# EAGLE schematic AUX power board (V4.0) (EAGLE 7.5.0)
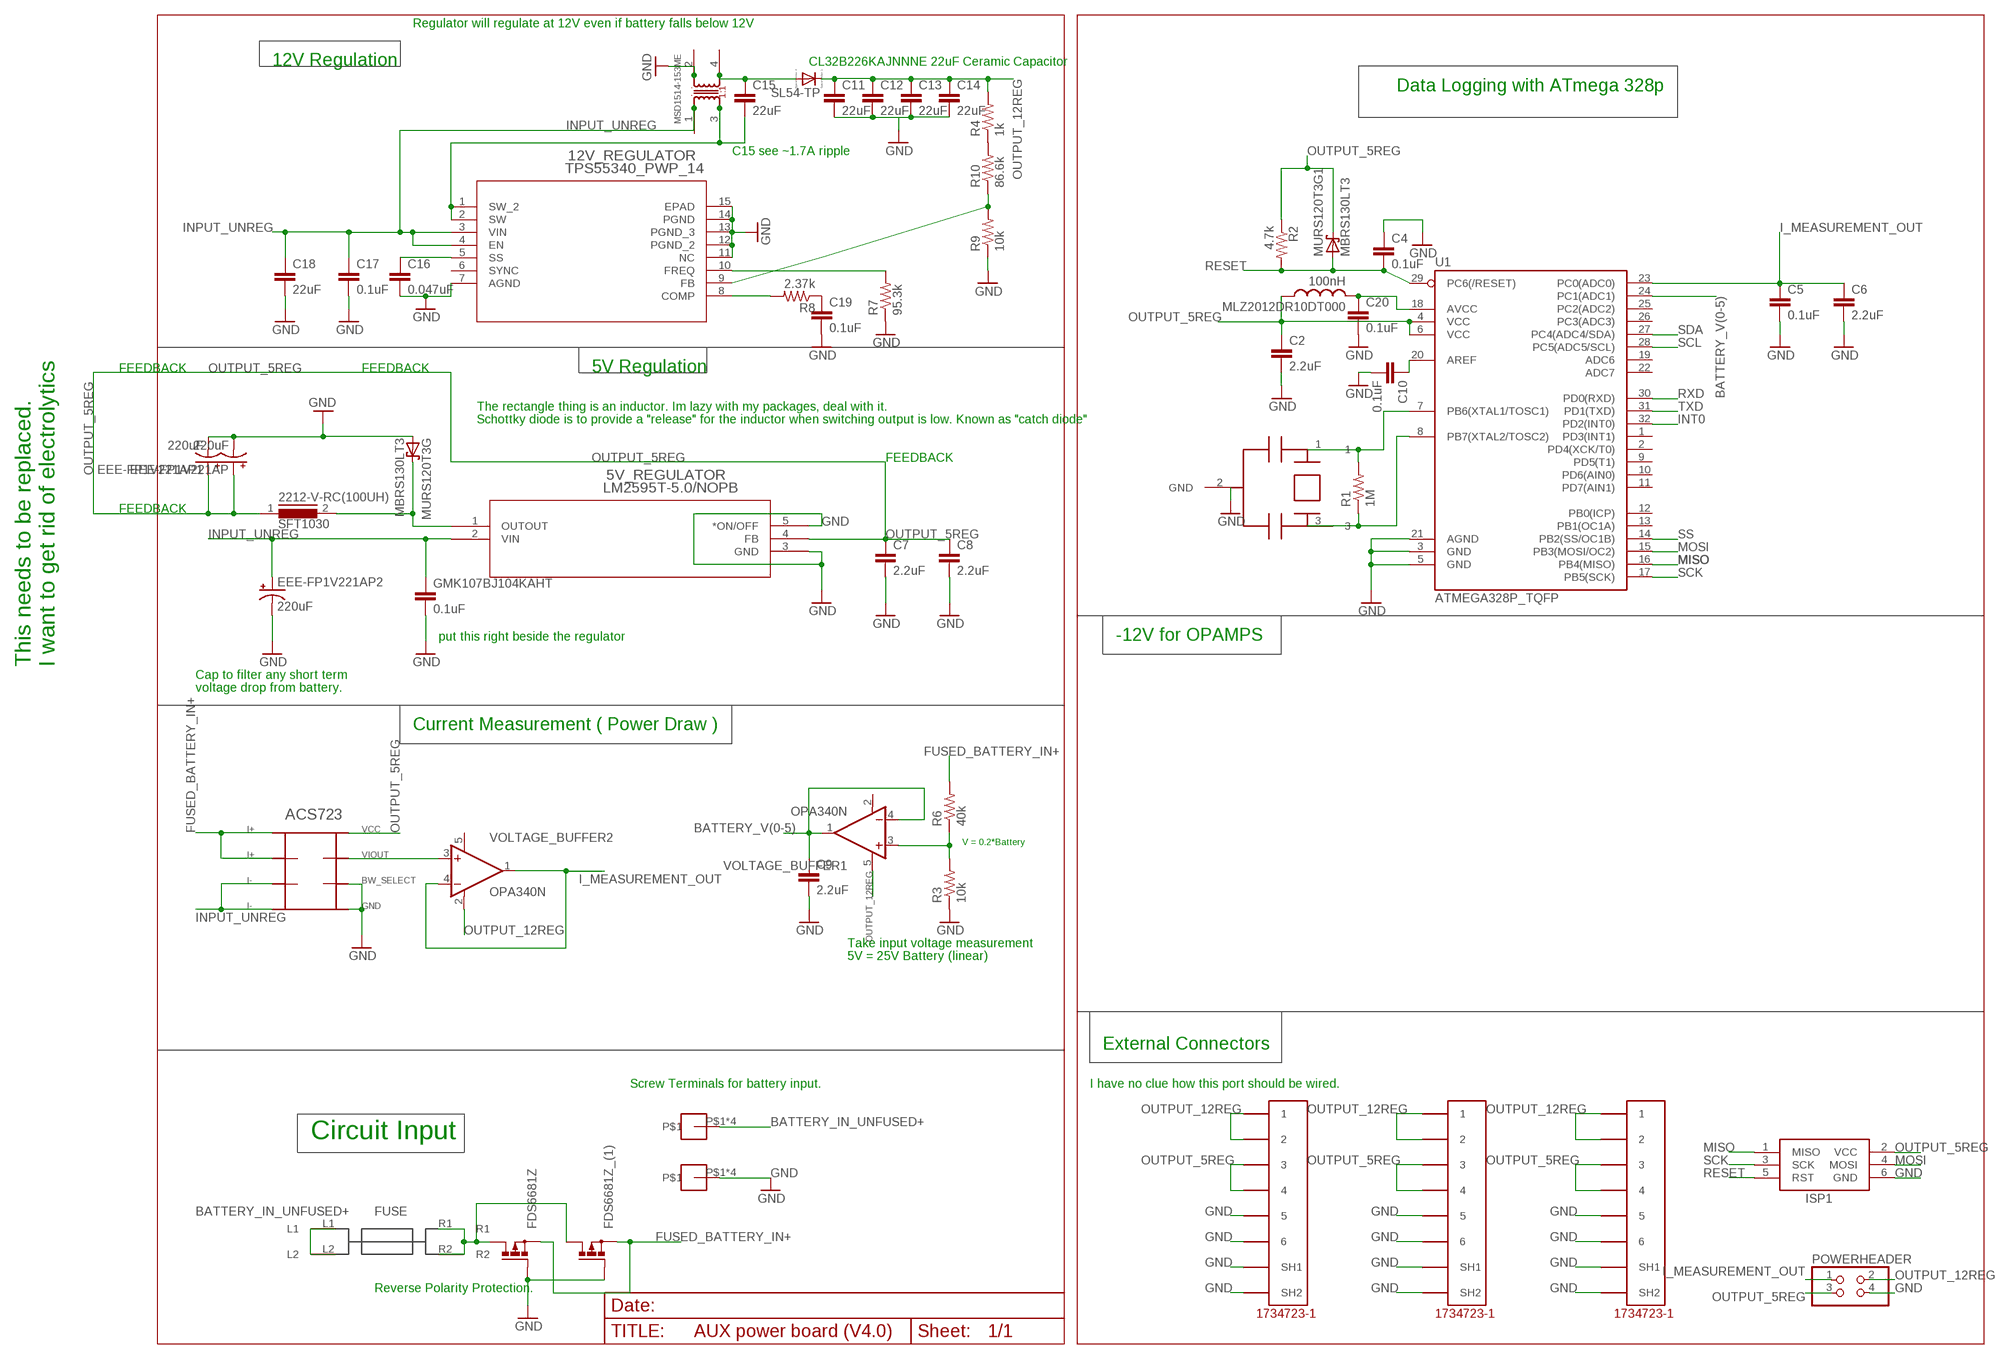
[diagram p0: schematic, sheet 1]

## Parts
5V_REGULATOR  LM2595T-5.0/NOPB  [T05D]
12V_REGULATOR  TPS55340_PWP_14  [PWP14]
16MHZ  CSTCE16M0V53-R0  [RESONATOR]
2212-V-RC(100UH)  SFT1030  [SFT1030]
C2  2.2uF  C-EUC0603  [C0603]
C4  0.1uF  C-EUC0603  [C0603]
C5  0.1uF  C-EUC0603  [C0603]
C6  2.2uF  C-EUC0603  [C0603]
C7  2.2uF  C-EUC0603  [C0603]
C8  2.2uF  C-EUC0603  [C0603]
C9  2.2uF  C-EUC0603  [C0603]
C10  0.1uF  C-EUC0603  [C0603]
C11  22uF  C-EUC1210  [C1210]
C12  22uF  C-EUC1210  [C1210]
C13  22uF  C-EUC1210  [C1210]
C14  22uF  C-EUC1210  [C1210]
C15  22uF  C-EUC1210  [C1210]
C16  0.047uF  C-EUC0603  [C0603]
C17  0.1uF  C-EUC0603  [C0603]
C18  22uF  C-EUC0603  [C0603]
C19  0.1uF  C-EUC0603  [C0603]
C20  0.1uF  C-EUC0603  [C0603]
EEE-FP1V221AP  220uF  CPOL-US175TMP-0808  [175TMP-0808]
EEE-FP1V221AP1  220uF  CPOL-US175TMP-0808  [175TMP-0808]
EEE-FP1V221AP2  220uF  CPOL-US175TMP-0808  [175TMP-0808]
FDS6681Z  P-MOSFET-SO8  [SO-08]
FDS6681Z_(1)  P-MOSFET-SO8  [SO-08]
GMK107BJ104KAHT  0.1uF  C-EUC0603  [C0603]
ISP1  AVRISP-6  [AVRISP]
MINIBLADE  3568  [3568]
MLZ2012DR10DT000  100nH  L-USL2012C  [L2012C]
MSD1514-153ME  MSD1514  [MSD1514]
MURS120T3G  MBRS130LT3  [SMB]
MURS120T3G1  MBRS130LT3  [SMB]
POWERHEADER  PINHD-2X2  [2X02]
R1  1M  R-US_R0603  [R0603]
R2  4.7k  R-US_R0603  [R0603]
R3  10k  R-US_R0603  [R0603]
R4  1k  R-US_R0603  [R0603]
R6  40k  R-US_R0603  [R0603]
R7  95.3k  R-US_R0603  [R0603]
R8  2.37k  R-US_R0603  [R0603]
R9  10k  R-US_R0603  [R0603]
R10  86.6k  R-US_R0603  [R0603]
SL54-TP  DIODE_E-SMC  [DIODE_SMC]
U1  ATMEGA328P_TQFP  [TQFP32-08]
U$1  ACS723  [SO08]
U$3  5555140-6  [1734723-1_RJ11]
U$4  5555140-6  [1734723-1_RJ11]
U$5  5555140-6  [1734723-1_RJ11]
U$6  SCREW-8191  [SCREW-8191]
U$7  SCREW-8191  [SCREW-8191]
VOLTAGE_BUFFER1  OPA340N  [SOT23-5]
VOLTAGE_BUFFER2  OPA340N  [SOT23-5]

## Nets
BATTERY_IN_UNFUSED+: MINIBLADE.L1 MINIBLADE.L2 U$6.P$1 U$6.P$2 U$6.P$3 U$6.P$4
BATTERY_V(0-5): C9.1 U1.24(PC1(ADC1)) VOLTAGE_BUFFER1.1(OUT) VOLTAGE_BUFFER1.4(-IN)
FUSED_BATTERY_IN+: FDS6681Z.1(S) FDS6681Z.2(S) FDS6681Z.3(S) FDS6681Z_(1).1(S) FDS6681Z_(1).2(S) FDS6681Z_(1).3(S) R6.2 U$1.1 U$1.2
GND: 5V_REGULATOR.3(GND) 5V_REGULATOR.5(*ON/OFF) 12V_REGULATOR.7(AGND) 12V_REGULATOR.11(NC) 12V_REGULATOR.12(PGND_2) 12V_REGULATOR.13(PGND_3) 12V_REGULATOR.14(PGND) 12V_REGULATOR.15(EPAD) 16MHZ.2(GND) C2.2 C4.1 C5.2 C6.2 C7.2 C8.2 C9.2 C10.2 C11.2 C12.2 C13.2 C14.2 C16.2 C17.2 C18.2 C19.2 C20.2 EEE-FP1V221AP1.- EEE-FP1V221AP2.- EEE-FP1V221AP.- FDS6681Z.4(G) FDS6681Z_(1).4(G) GMK107BJ104KAHT.2 ISP1.6(GND) MSD1514-153ME.2 MURS120T3G.A POWERHEADER.4 R3.1 R7.1 R9.1 U1.3(GND) U1.5(GND) U1.21(AGND) U$1.5 U$1.6 U$3.5 U$3.6 U$3.SH1 U$3.SH2 U$4.5 U$4.6 U$4.SH1 U$4.SH2 U$5.5 U$5.6 U$5.SH1 U$5.SH2 U$7.P$1 U$7.P$2 U$7.P$3 U$7.P$4
I_MEASUREMENT_OUT: C5.1 C6.1 POWERHEADER.1 U1.23(PC0(ADC0)) VOLTAGE_BUFFER2.1(OUT) VOLTAGE_BUFFER2.4(-IN)
INPUT_UNREG: 5V_REGULATOR.2(VIN) 12V_REGULATOR.3(VIN) 12V_REGULATOR.4(EN) C17.1 C18.1 EEE-FP1V221AP2.+ GMK107BJ104KAHT.1 MSD1514-153ME.1 U$1.3 U$1.4
INT0: U1.32(PD2(INT0))
MISO: ISP1.1(MISO) U1.16(PB4(MISO))
MMM: FDS6681Z.5(D) FDS6681Z.6(D) FDS6681Z.7(D) FDS6681Z.8(D) FDS6681Z_(1).5(D) FDS6681Z_(1).6(D) FDS6681Z_(1).7(D) FDS6681Z_(1).8(D) MINIBLADE.R1 MINIBLADE.R2
MOSI: ISP1.4(MOSI) U1.15(PB3(MOSI/OC2))
N$1: 5V_REGULATOR.1(OUTOUT) 2212-V-RC(100UH).2 MURS120T3G.C
N$2: U$1.7 VOLTAGE_BUFFER2.3(+IN)
N$3: R4.1 R10.2
N$4: 12V_REGULATOR.1(SW_2) 12V_REGULATOR.2(SW) C15.2 MSD1514-153ME.3
N$5: C20.1 MLZ2012DR10DT000.2 U1.18(AVCC)
N$6: C15.1 MSD1514-153ME.4 SL54-TP.A(C)
N$8: 12V_REGULATOR.5(SS) C16.1
N$9: 12V_REGULATOR.8(COMP) R8.2
N$10: 12V_REGULATOR.10(FREQ) R7.2
N$12: R3.2 R6.1 VOLTAGE_BUFFER1.3(+IN)
N$13: C19.1 R8.1
N$14: C10.1 U1.20(AREF)
N$15: 12V_REGULATOR.9(FB) R9.2 R10.1
N$18: 16MHZ.1 R1.2 U1.7(PB6(XTAL1/TOSC1))
N$19: 16MHZ.3 R1.1 U1.8(PB7(XTAL2/TOSC2))
OUTPUT_5REG: 5V_REGULATOR.4(FB) 2212-V-RC(100UH).1 C2.1 C7.1 C8.1 EEE-FP1V221AP1.+ EEE-FP1V221AP.+ ISP1.2(VCC) MLZ2012DR10DT000.1 MURS120T3G1.C POWERHEADER.3 R2.1 U1.4(VCC) U1.6(VCC) U$1.8 U$3.3 U$3.4 U$4.3 U$4.4 U$5.3 U$5.4
OUTPUT_12REG: C11.1 C12.1 C13.1 C14.1 POWERHEADER.2 R4.2 SL54-TP.C(A) U$3.1 U$3.2 U$4.1 U$4.2 U$5.1 U$5.2 VOLTAGE_BUFFER1.5(V+)
RESET: C4.2 ISP1.5(RST) MURS120T3G1.A R2.2 U1.29(PC6(/RESET))
RXD: U1.30(PD0(RXD))
SCK: ISP1.3(SCK) U1.17(PB5(SCK))
SCL: U1.28(PC5(ADC5/SCL))
SDA: U1.27(PC4(ADC4/SDA))
SS: U1.14(PB2(SS/OC1B))
TXD: U1.31(PD1(TXD))
Unconnected: 12V_REGULATOR.6(SYNC) U1.1(PD3(INT1)) U1.2(PD4(XCK/T0)) U1.9(PD5(T1)) U1.10(PD6(AIN0)) U1.11(PD7(AIN1)) U1.12(PB0(ICP)) U1.13(PB1(OC1A)) U1.19(ADC6) U1.22(ADC7) U1.25(PC2(ADC2)) U1.26(PC3(ADC3))

## Notes on the sheet
- Regulator will regulate at 12V even if battery falls below 12V
- 12V Regulation | CL32B226KAJNNNE 22uF Ceramic Capacitor
- Data Logging with ATmega 328p
- C15 see ~1.7A ripple
- FEEDBACK | FEEDBACK | 5V Regulation
- The rectangle thing is an inductor. Im lazy with my packages, deal with it.
- Schottky diode is to provide a "release" for the inductor when switching output is low. Known as "catch diode"
- FEEDBACK
- FEEDBACK
- put this right beside the regulator | -12V for OPAMPS
- This needs to be replaced.
  I want to get rid of electrolytics
- Cap to filter any short term
- voltage drop from battery.
- Current Measurement ( Power Draw )
- V = 0.2*Battery
- Take input voltage measurement
- 5V = 25V Battery (linear)
- External Connectors
- Screw Terminals for battery input. | I have no clue how this port should be wired.
- Circuit Input
- Reverse Polarity Protection.

## Power pins joined to a net without a drawn wire
V+: VOLTAGE_BUFFER2.5(V+)
V-: VOLTAGE_BUFFER1.2(V-) VOLTAGE_BUFFER2.2(V-)

## Library data of the parts
5V_REGULATOR = LM2595T-5:LM2595T-5.0/NOPB; COPYRIGHT: Copyright C 2015 Accelerated Designs. All rights reserved; MANUFACTURER_PART_NUMBER: LM2595T50; VENDOR: National Semiconductor
12V_REGULATOR = TPS55340PWP:TPS55340_PWP_14; MANUFACTURER_PART_NUMBER: tps55340_pwp_14; VENDOR: Texas Instruments
16MHZ = arduino_Uno_Rev3-02-TH:CSTCE16M0V53-R0
2212-V-RC(100UH) = inductors:SFT1030: INDUCTOR
C2 C10 = resistor:C-EU: CAPACITOR, European symbol
C4-C9 C11-C20 GMK107BJ104KAHT = rcl:C-EU: CAPACITOR, European symbol
EEE-FP1V221AP EEE-FP1V221AP1 EEE-FP1V221AP2 = rcl:CPOL-US: POLARIZED CAPACITOR, American symbol
FDS6681Z FDS6681Z_(1) = transistor-power:P-MOSFET-SO8: P-Channel MOSFET Example: FDS4435A; P-Channel Logic Level PowerTrench® MOSFET FDS4465; P-Channel 1.8V Specified PowerTrench® MOSFET Source: www.fairchildsemi.com
ISP1 = adafruit:AVRISP: AVR ISP HEADER Standard 6 pin header for AVR programming
MINIBLADE = fuse:3568
MLZ2012DR10DT000 = resistor:L-US: INDUCTOR, American symbol
MSD1514-153ME = MSD1514:MSD1514
MURS120T3G MURS120T3G1 = diode:MBRS130LT3: Schottky Power Rectifier Source: http://www.onsemi.com/pub/Collateral/MBRS130LT3-D.PDF
POWERHEADER = pinhead:PINHD-2X2: PIN HEADER
R1 = rcl:R-US_: RESISTOR, American symbol
R2-R4 R6-R10 = resistor:R-US_: RESISTOR, American symbol
SL54-TP = eagle-ltspice:DIODE_E-: Schottky Diode; SPICEMODEL: diode; SPICEPREFIX: D
U1 = SparkFun-DigitalIC:ATMEGA328P_TQFP; PROD_ID: IC-09069
U$1 = linear:ACS723
U$3-U$5 = 5555140-6 RJ11:5555140-6
U$6 U$7 = Shell2013:SCREW-8191
VOLTAGE_BUFFER1 VOLTAGE_BUFFER2 = burr-brown:OPA340: Rail-to-Rail Operational Amplifiers Single-Supply, MicroAmplifier(TM) Series; MPN: OPA340NA/3KG4; OC_FARNELL: 1234805; OC_NEWARK: 13M5177